# EAGLE board eBay1 (EAGLE 6.6.0), part 1 of 7
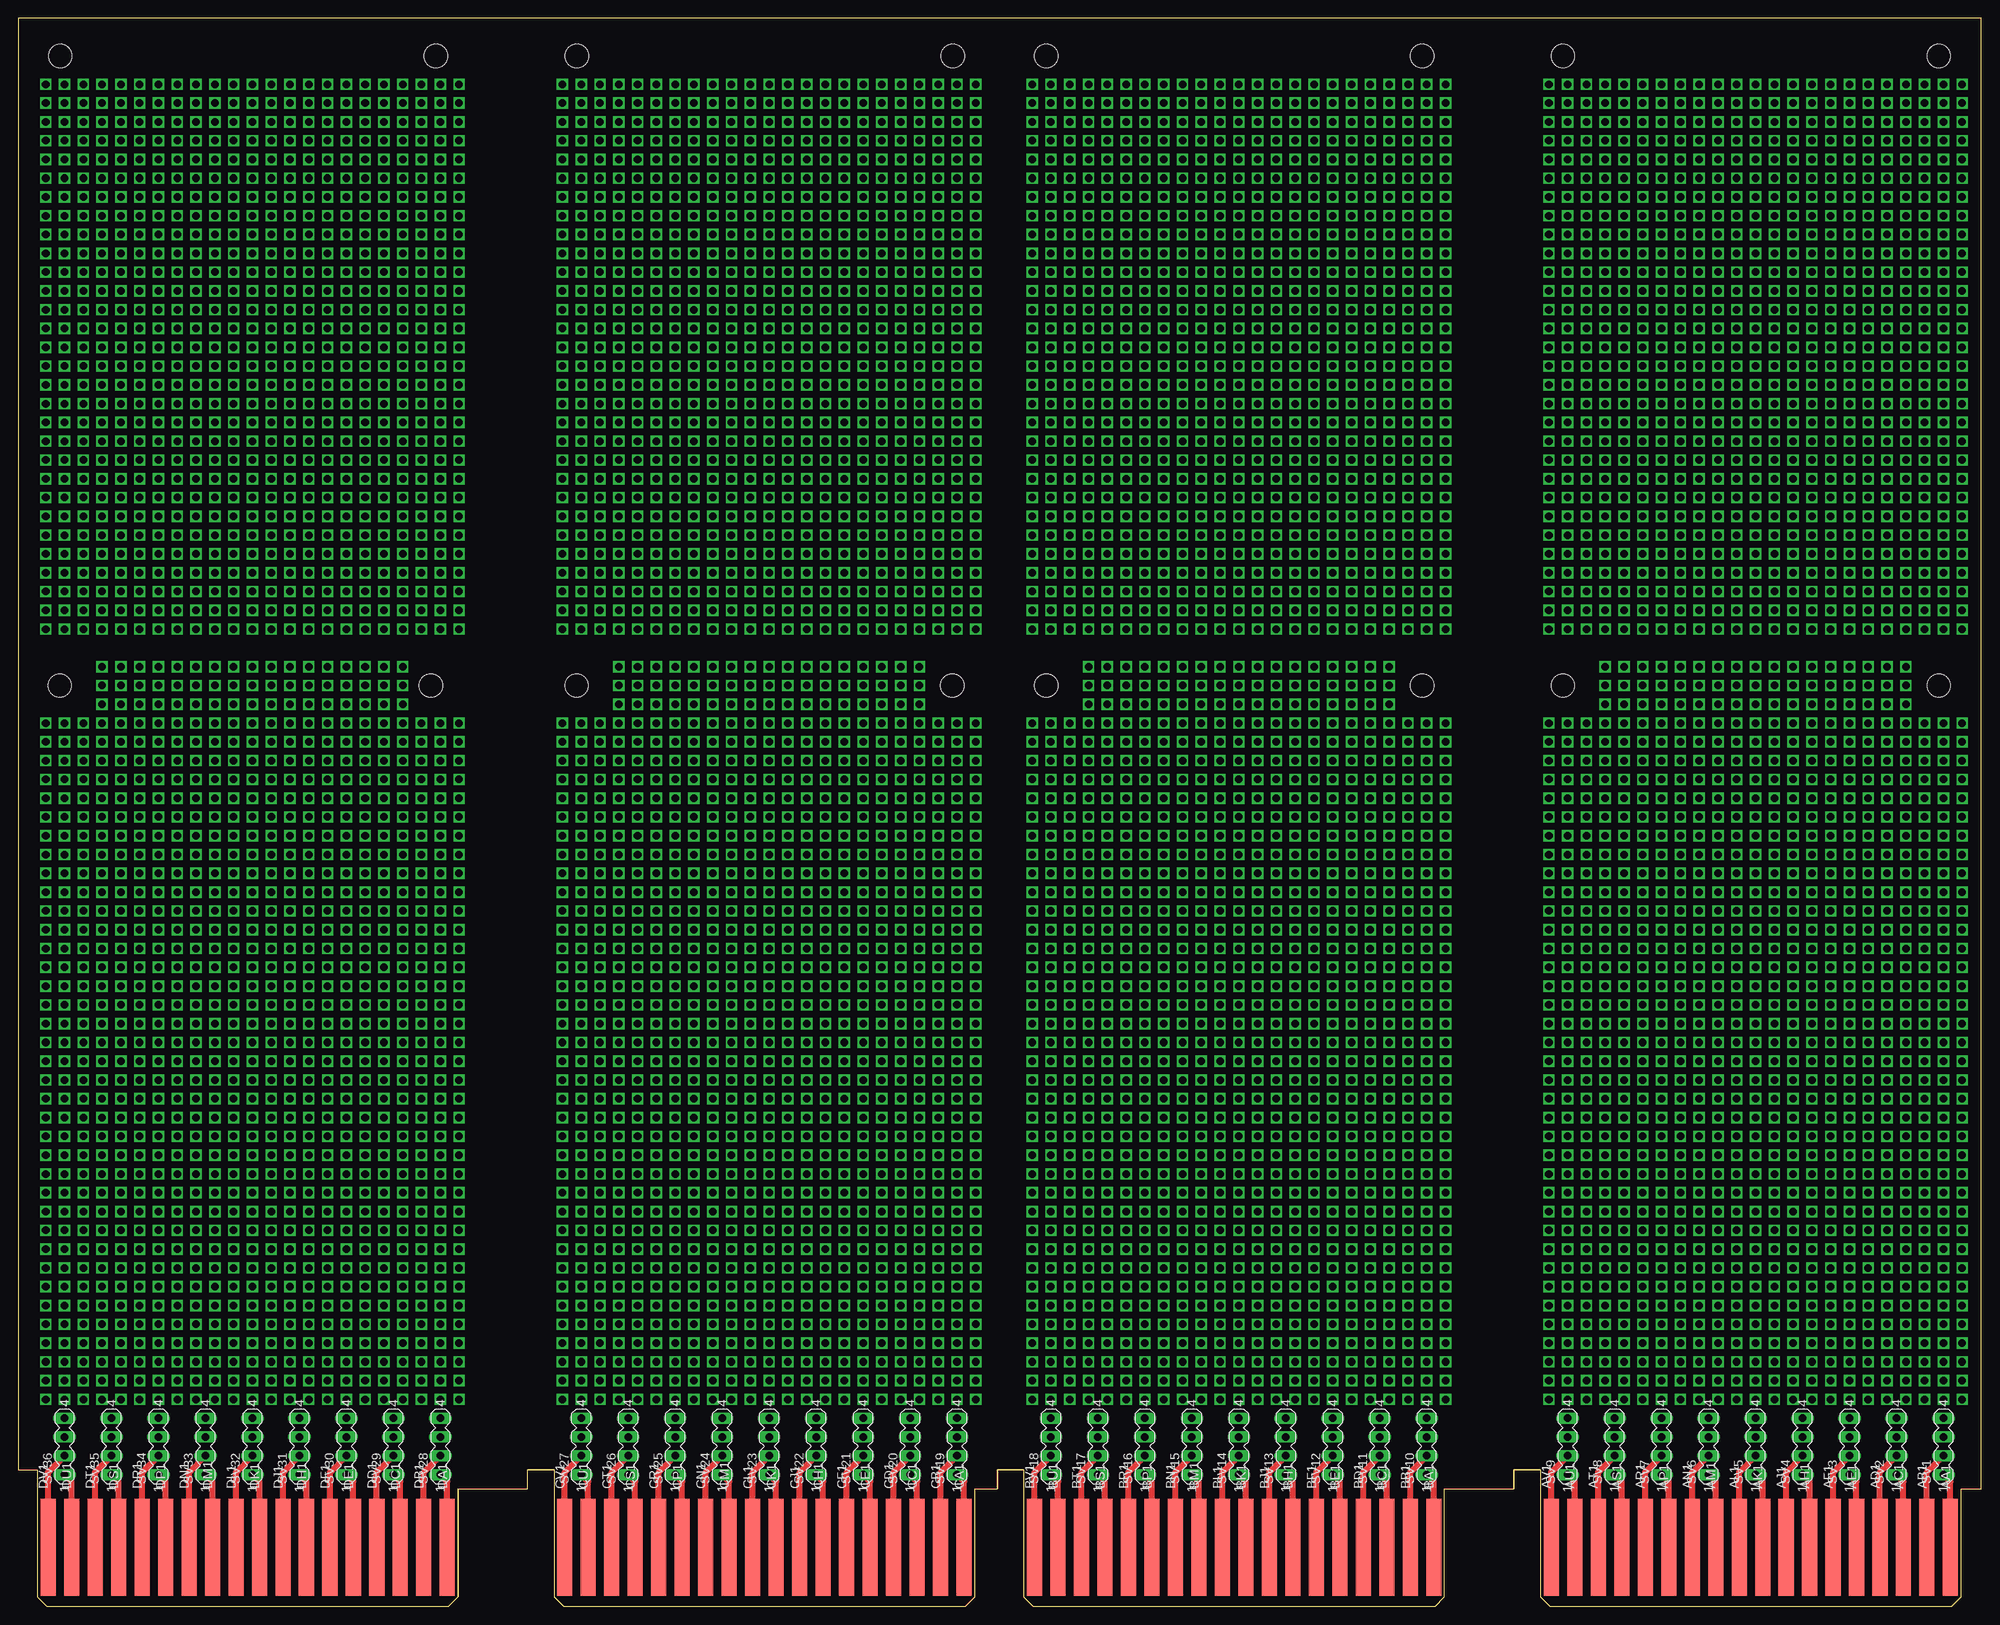
[diagram p1: board, top side]
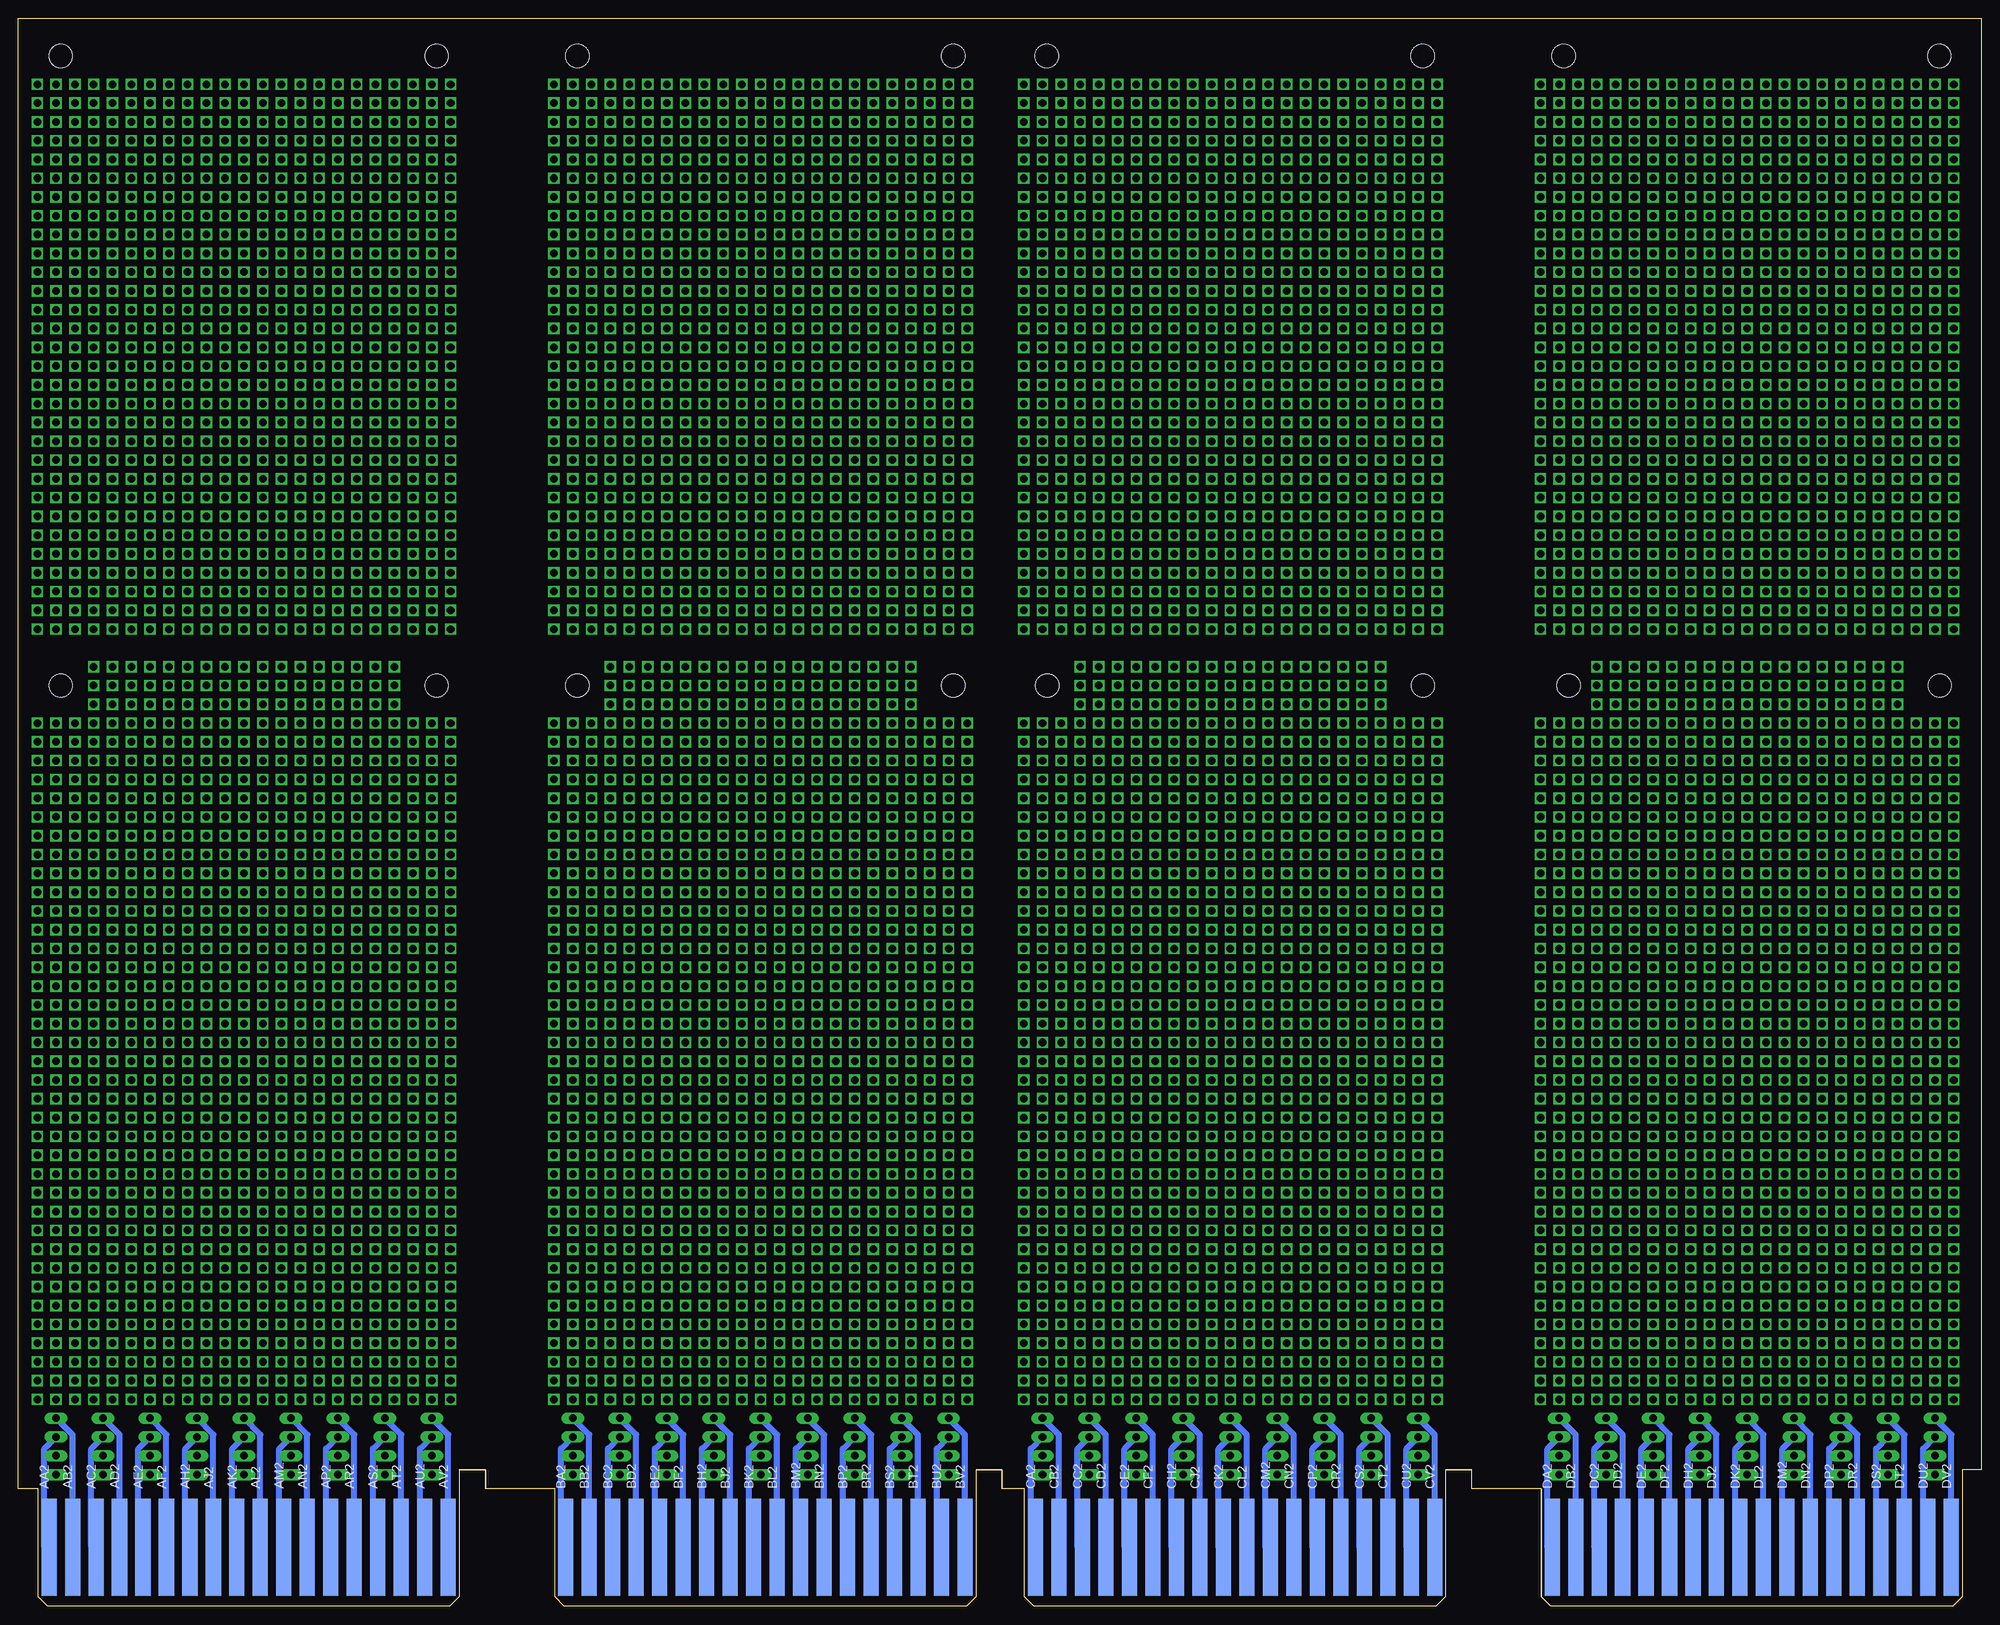
[diagram p2: board, bottom side, seen from below]

Size 265.3 x 214.63 mm. Coordinates in mm from the lower left corner, seen from the top.
Copper layers (1+16): Top 0.035mm / dielectric 1.5mm / Bottom 0.035mm
Design rules "16mils *": minimum track width 16mil, minimum drill 32mil, track to track 15mil, track to pad 10mil, pad to pad 10mil, via to via 10mil, smd to smd 10mil, copper to edge 13mil, drill to drill 10mil, minimum pad ring 10mil, minimum via ring 8mil, stop-mask expansion 0mil, vias tented up to drill 0mil, thermal gap 10mil
Net classes: 0 default: width 0.813 mm
Holes 3.17 mm at 5.59,124.46 55.75,124.46 75.44,124.46 126.24,124.46 138.94,124.46 189.74,124.46 208.79,124.46 259.59,124.46

## Footprints (pad centres in the part's own frame; a part is rotated, then mirrored left to right if it is on the bottom)
MA04-1 = drill 1.016 long: 1 -3.81,0; 2 -1.27,0; 3 1.27,0; 4 3.81,0
OMNIBUS = hole 3.175: 208.915,209.55; 259.715,209.55; 189.865,209.55; 139.065,209.55; 75.616,209.55; 126.416,209.55; 56.566,209.55; 5.766,209.55
EDGE-CON8 = smd 2.032 x 13.106: AA1 261.303,7.938; AB1 258.127,7.938; AC1 254.952,7.938; AD1 251.778,7.938; AE1 248.602,7.938; AF1 245.428,7.938; AH1 242.252,7.938; AJ1 239.077,7.938; AK1 235.903,7.938; AL1 232.727,7.938; AM1 229.553,7.938; AN1 226.377,7.938; AP1 223.202,7.938; AR1 220.028,7.938; AS1 216.852,7.938; AT1 213.678,7.938; AU1 210.502,7.938; AV1 207.327,7.938; BA1 191.452,7.938; BB1 188.278,7.938; BC1 185.102,7.938; BD1 181.928,7.938; BE1 178.752,7.938; BF1 175.577,7.938; BH1 172.403,7.938; BJ1 169.227,7.938; BK1 166.053,7.938; BL1 162.877,7.938; BM1 159.702,7.938; BN1 156.528,7.938; BP1 153.352,7.938; BR1 150.178,7.938; BS1 147.002,7.938; BT1 143.827,7.938; BU1 140.653,7.938; BV1 137.477,7.938; CA1 127.953,7.938; CB1 124.778,7.938; CC1 121.603,7.938; CD1 118.427,7.938; CE1 115.252,7.938; CF1 112.078,7.938; CH1 108.903,7.938; CJ1 105.728,7.938; CK1 102.552,7.938; CL1 99.377,7.938; CM1 96.203,7.938; CN1 93.028,7.938; CP1 89.853,7.938; CR1 86.677,7.938; CS1 83.502,7.938; CT1 80.328,7.938; CU1 77.153,7.938; CV1 73.978,7.938; DA1 58.102,7.938; DB1 54.928,7.938; DC1 51.752,7.938; DD1 48.578,7.938; DE1 45.403,7.938; DF1 42.227,7.938; DH1 39.053,7.938; DJ1 35.877,7.938; DK1 32.703,7.938; DL1 29.527,7.938; DM1 26.352,7.938; DN1 23.177,7.938; DP1 20.003,7.938; DR1 16.828,7.938; DS1 13.652,7.938; DT1 10.477,7.938; DU1 7.303,7.938; DV1 4.128,7.938 | smd 2.032 x 13.106 bottom: AA2 261.303,7.938; AB2 258.127,7.938; AC2 254.952,7.938; AD2 251.778,7.938; AE2 248.602,7.938; AF2 245.428,7.938; AH2 242.252,7.938; AJ2 239.077,7.938; AK2 235.903,7.938; AL2 232.727,7.938; AM2 229.553,7.938; AN2 226.377,7.938; AP2 223.202,7.938; AR2 220.028,7.938; AS2 216.852,7.938; AT2 213.678,7.938; AU2 210.502,7.938; AV2 207.327,7.938; BA2 191.452,7.938; BB2 188.278,7.938; BC2 185.102,7.938; BD2 181.928,7.938; BE2 178.752,7.938; BF2 175.577,7.938; BH2 172.403,7.938; BJ2 169.227,7.938; BK2 166.053,7.938; BL2 162.877,7.938; BM2 159.702,7.938; BN2 156.528,7.938; BP2 153.352,7.938; BR2 150.178,7.938; BS2 147.002,7.938; BT2 143.827,7.938; BU2 140.653,7.938; BV2 137.477,7.938; CA2 127.953,7.938; CB2 124.778,7.938; CC2 121.603,7.938; CD2 118.427,7.938; CE2 115.252,7.938; CF2 112.078,7.938; CH2 108.903,7.938; CJ2 105.728,7.938; CK2 102.552,7.938; CL2 99.377,7.938; CM2 96.203,7.938; CN2 93.028,7.938; CP2 89.853,7.938; CR2 86.677,7.938; CS2 83.502,7.938; CT2 80.328,7.938; CU2 77.153,7.938; CV2 73.978,7.938; DA2 58.102,7.938; DB2 54.928,7.938; DC2 51.752,7.938; DD2 48.578,7.938; DE2 45.403,7.938; DF2 42.227,7.938; DH2 39.053,7.938; DJ2 35.877,7.938; DK2 32.703,7.938; DL2 29.527,7.938; DM2 26.352,7.938; DN2 23.177,7.938; DP2 20.003,7.938; DR2 16.828,7.938; DS2 13.652,7.938; DT2 10.477,7.938; DU2 7.303,7.938; DV2 4.128,7.938

## Placement (x,y rotation side)
SV1  [MA04-1]  260.22,21.59 90 top
SV2  [MA04-1]  253.87,21.59 90 top
SV3  [MA04-1]  247.52,21.59 90 top
SV4  [MA04-1]  241.17,21.59 90 top
SV5  [MA04-1]  234.82,21.59 90 top
SV6  [MA04-1]  228.47,21.59 90 top
SV7  [MA04-1]  222.12,21.59 90 top
SV8  [MA04-1]  215.77,21.59 90 top
SV9  [MA04-1]  209.42,21.59 90 top
SV10  [MA04-1]  190.37,21.59 90 top
SV11  [MA04-1]  184.02,21.59 90 top
SV12  [MA04-1]  177.67,21.59 90 top
SV13  [MA04-1]  171.32,21.59 90 top
SV14  [MA04-1]  164.97,21.59 90 top
SV15  [MA04-1]  158.62,21.59 90 top
SV16  [MA04-1]  152.27,21.59 90 top
SV17  [MA04-1]  145.92,21.59 90 top
SV18  [MA04-1]  139.57,21.59 90 top
SV19  [MA04-1]  126.87,21.59 90 top
SV20  [MA04-1]  120.52,21.59 90 top
SV21  [MA04-1]  114.17,21.59 90 top
SV22  [MA04-1]  107.82,21.59 90 top
SV23  [MA04-1]  101.47,21.59 90 top
SV24  [MA04-1]  95.12,21.59 90 top
SV25  [MA04-1]  88.77,21.59 90 top
SV26  [MA04-1]  82.42,21.59 90 top
SV27  [MA04-1]  76.07,21.59 90 top
SV28  [MA04-1]  57.02,21.59 90 top
SV29  [MA04-1]  50.67,21.59 90 top
SV30  [MA04-1]  44.32,21.59 90 top
SV31  [MA04-1]  37.97,21.59 90 top
SV32  [MA04-1]  31.62,21.59 90 top
SV33  [MA04-1]  25.27,21.59 90 top
SV34  [MA04-1]  18.92,21.59 90 top
SV35  [MA04-1]  12.57,21.59 90 top
SV36  [MA04-1]  6.22,21.59 90 top
U$1  OUTLINE-OMNIBUS  [OMNIBUS]  -0.13,0 0 top
U$2  QUAD  [EDGE-CON8]  -0.13,0 0 top

## Tracks (layer width: path | path; a pad name or v marks a point on that pad's centre or on a via)
N$1  (via drill 1.02)
  other vias: 262.76,27.94
N$2  (via drill 1.02)
  other vias: 260.22,27.94
N$3  (via drill 1.02)
  other vias: 257.68,27.94
N$4  (via drill 1.02)
  other vias: 255.14,27.94
N$5  (via drill 1.02)
  other vias: 252.6,27.94
N$6  (via drill 1.02)
  other vias: 250.06,27.94
N$7  (via drill 1.02)
  other vias: 247.52,27.94
N$8  (via drill 1.02)
  other vias: 244.98,27.94
N$9  (via drill 1.02)
  other vias: 242.44,27.94
N$10  (via drill 1.02)
  other vias: 239.9,27.94
N$11  (via drill 1.02)
  other vias: 237.36,27.94
N$12  (via drill 1.02)
  other vias: 234.82,27.94
N$13  (via drill 1.02)
  other vias: 232.28,27.94
N$14  (via drill 1.02)
  other vias: 229.74,27.94
N$15  (via drill 1.02)
  other vias: 227.2,27.94
N$16  (via drill 1.02)
  other vias: 224.66,27.94
N$17  (via drill 1.02)
  other vias: 222.12,27.94
N$18  (via drill 1.02)
  other vias: 219.58,27.94
N$19  (via drill 1.02)
  other vias: 217.04,27.94
N$20  (via drill 1.02)
  other vias: 214.5,27.94
N$21  (via drill 1.02)
  other vias: 211.96,27.94
N$22  (via drill 1.02)
  other vias: 209.42,27.94
N$23  (via drill 1.02)
  other vias: 206.88,27.94
N$24  (via drill 1.02)
  other vias: 192.91,27.94
N$25  (via drill 1.02)
  other vias: 190.37,27.94
N$26  (via drill 1.02)
  other vias: 262.76,30.48
N$27  (via drill 1.02)
  other vias: 260.22,30.48
N$28  (via drill 1.02)
  other vias: 257.68,30.48
N$29  (via drill 1.02)
  other vias: 255.14,30.48
N$30  (via drill 1.02)
  other vias: 252.6,30.48
N$31  (via drill 1.02)
  other vias: 250.06,30.48
N$32  (via drill 1.02)
  other vias: 247.52,30.48
N$33  (via drill 1.02)
  other vias: 244.98,30.48
N$34  (via drill 1.02)
  other vias: 242.44,30.48
N$35  (via drill 1.02)
  other vias: 239.9,30.48
N$36  (via drill 1.02)
  other vias: 237.36,30.48
N$37  (via drill 1.02)
  other vias: 234.82,30.48
N$38  (via drill 1.02)
  other vias: 232.28,30.48
N$39  (via drill 1.02)
  other vias: 229.74,30.48
N$40  (via drill 1.02)
  other vias: 227.2,30.48
N$41  (via drill 1.02)
  other vias: 224.66,30.48
N$42  (via drill 1.02)
  other vias: 222.12,30.48
N$43  (via drill 1.02)
  other vias: 219.58,30.48
N$44  (via drill 1.02)
  other vias: 217.04,30.48
N$45  (via drill 1.02)
  other vias: 214.5,30.48
N$46  (via drill 1.02)
  other vias: 211.96,30.48
N$47  (via drill 1.02)
  other vias: 209.42,30.48
N$48  (via drill 1.02)
  other vias: 206.88,30.48
N$49  (via drill 1.02)
  other vias: 187.83,27.94
N$50  (via drill 1.02)
  other vias: 185.29,27.94
N$51  (via drill 1.02)
  other vias: 262.76,33.02
N$52  (via drill 1.02)
  other vias: 260.22,33.02
N$53  (via drill 1.02)
  other vias: 257.68,33.02
N$54  (via drill 1.02)
  other vias: 255.14,33.02
N$55  (via drill 1.02)
  other vias: 252.6,33.02
N$56  (via drill 1.02)
  other vias: 250.06,33.02
N$57  (via drill 1.02)
  other vias: 247.52,33.02
N$58  (via drill 1.02)
  other vias: 244.98,33.02
N$59  (via drill 1.02)
  other vias: 242.44,33.02
N$60  (via drill 1.02)
  other vias: 239.9,33.02
N$61  (via drill 1.02)
  other vias: 237.36,33.02
N$62  (via drill 1.02)
  other vias: 234.82,33.02
N$63  (via drill 1.02)
  other vias: 232.28,33.02
N$64  (via drill 1.02)
  other vias: 229.74,33.02
N$65  (via drill 1.02)
  other vias: 227.2,33.02
N$66  (via drill 1.02)
  other vias: 224.66,33.02
N$67  (via drill 1.02)
  other vias: 222.12,33.02
N$68  (via drill 1.02)
  other vias: 219.58,33.02
N$69  (via drill 1.02)
  other vias: 217.04,33.02
N$70  (via drill 1.02)
  other vias: 214.5,33.02
N$71  (via drill 1.02)
  other vias: 211.96,33.02
N$72  (via drill 1.02)
  other vias: 209.42,33.02
N$73  (via drill 1.02)
  other vias: 206.88,33.02
N$74  (via drill 1.02)
  other vias: 182.75,27.94
N$75  (via drill 1.02)
  other vias: 180.21,27.94
N$76  (via drill 1.02)
  other vias: 262.76,35.56
N$77  (via drill 1.02)
  other vias: 260.22,35.56
N$78  (via drill 1.02)
  other vias: 257.68,35.56
N$79  (via drill 1.02)
  other vias: 255.14,35.56
N$80  (via drill 1.02)
  other vias: 252.6,35.56
N$81  (via drill 1.02)
  other vias: 250.06,35.56
N$82  (via drill 1.02)
  other vias: 247.52,35.56
N$83  (via drill 1.02)
  other vias: 244.98,35.56
N$84  (via drill 1.02)
  other vias: 242.44,35.56
N$85  (via drill 1.02)
  other vias: 239.9,35.56
N$86  (via drill 1.02)
  other vias: 237.36,35.56
N$87  (via drill 1.02)
  other vias: 234.82,35.56
N$88  (via drill 1.02)
  other vias: 232.28,35.56
N$89  (via drill 1.02)
  other vias: 229.74,35.56
N$90  (via drill 1.02)
  other vias: 227.2,35.56
N$91  (via drill 1.02)
  other vias: 224.66,35.56
N$92  (via drill 1.02)
  other vias: 222.12,35.56
N$93  (via drill 1.02)
  other vias: 219.58,35.56
N$94  (via drill 1.02)
  other vias: 217.04,35.56
N$95  (via drill 1.02)
  other vias: 214.5,35.56
N$96  (via drill 1.02)
  other vias: 211.96,35.56
N$97  (via drill 1.02)
  other vias: 209.42,35.56
N$98  (via drill 1.02)
  other vias: 206.88,35.56
N$99  (via drill 1.02)
  other vias: 177.67,27.94
N$100  (via drill 1.02)
  other vias: 175.13,27.94
N$101  (via drill 1.02)
  other vias: 262.76,38.1
N$102  (via drill 1.02)
  other vias: 260.22,38.1
N$103  (via drill 1.02)
  other vias: 257.68,38.1
N$104  (via drill 1.02)
  other vias: 255.14,38.1
N$105  (via drill 1.02)
  other vias: 252.6,38.1
N$106  (via drill 1.02)
  other vias: 250.06,38.1
N$107  (via drill 1.02)
  other vias: 247.52,38.1
N$108  (via drill 1.02)
  other vias: 244.98,38.1
N$109  (via drill 1.02)
  other vias: 242.44,38.1
N$110  (via drill 1.02)
  other vias: 239.9,38.1
N$111  (via drill 1.02)
  other vias: 237.36,38.1
N$112  (via drill 1.02)
  other vias: 234.82,38.1
N$113  (via drill 1.02)
  other vias: 232.28,38.1
N$114  (via drill 1.02)
  other vias: 229.74,38.1
N$115  (via drill 1.02)
  other vias: 227.2,38.1
N$116  (via drill 1.02)
  other vias: 224.66,38.1
N$117  (via drill 1.02)
  other vias: 222.12,38.1
N$118  (via drill 1.02)
  other vias: 219.58,38.1
N$119  (via drill 1.02)
  other vias: 217.04,38.1
N$120  (via drill 1.02)
  other vias: 214.5,38.1
N$121  (via drill 1.02)
  other vias: 211.96,38.1
N$122  (via drill 1.02)
  other vias: 209.42,38.1
N$123  (via drill 1.02)
  other vias: 206.88,38.1
N$124  (via drill 1.02)
  other vias: 172.59,27.94
N$125  (via drill 1.02)
  other vias: 170.05,27.94
N$126  (via drill 1.02)
  other vias: 262.76,40.64
N$127  (via drill 1.02)
  other vias: 260.22,40.64
N$128  (via drill 1.02)
  other vias: 257.68,40.64
N$129  (via drill 1.02)
  other vias: 255.14,40.64
N$130  (via drill 1.02)
  other vias: 252.6,40.64
N$131  (via drill 1.02)
  other vias: 250.06,40.64
N$132  (via drill 1.02)
  other vias: 247.52,40.64
N$133  (via drill 1.02)
  other vias: 244.98,40.64
N$134  (via drill 1.02)
  other vias: 242.44,40.64
N$135  (via drill 1.02)
  other vias: 239.9,40.64
N$136  (via drill 1.02)
  other vias: 237.36,40.64
N$137  (via drill 1.02)
  other vias: 234.82,40.64
N$138  (via drill 1.02)
  other vias: 232.28,40.64
N$139  (via drill 1.02)
  other vias: 229.74,40.64
N$140  (via drill 1.02)
  other vias: 227.2,40.64
N$141  (via drill 1.02)
  other vias: 224.66,40.64
N$142  (via drill 1.02)
  other vias: 222.12,40.64
N$143  (via drill 1.02)
  other vias: 219.58,40.64
N$144  (via drill 1.02)
  other vias: 217.04,40.64
N$145  (via drill 1.02)
  other vias: 214.5,40.64
N$146  (via drill 1.02)
  other vias: 211.96,40.64
N$147  (via drill 1.02)
  other vias: 209.42,40.64
N$148  (via drill 1.02)
  other vias: 206.88,40.64
N$149  (via drill 1.02)
  other vias: 167.51,27.94
N$150  (via drill 1.02)
  other vias: 164.97,27.94
N$151  (via drill 1.02)
  other vias: 262.76,43.18
N$152  (via drill 1.02)
  other vias: 260.22,43.18
N$153  (via drill 1.02)
  other vias: 257.68,43.18
N$154  (via drill 1.02)
  other vias: 255.14,43.18
N$155  (via drill 1.02)
  other vias: 252.6,43.18
N$156  (via drill 1.02)
  other vias: 250.06,43.18
N$157  (via drill 1.02)
  other vias: 247.52,43.18
N$158  (via drill 1.02)
  other vias: 244.98,43.18
N$159  (via drill 1.02)
  other vias: 242.44,43.18
N$160  (via drill 1.02)
  other vias: 239.9,43.18
N$161  (via drill 1.02)
  other vias: 237.36,43.18
N$162  (via drill 1.02)
  other vias: 234.82,43.18
N$163  (via drill 1.02)
  other vias: 232.28,43.18
N$164  (via drill 1.02)
  other vias: 229.74,43.18
N$165  (via drill 1.02)
  other vias: 227.2,43.18
N$166  (via drill 1.02)
  other vias: 224.66,43.18
N$167  (via drill 1.02)
  other vias: 222.12,43.18
N$168  (via drill 1.02)
  other vias: 219.58,43.18
N$169  (via drill 1.02)
  other vias: 217.04,43.18
N$170  (via drill 1.02)
  other vias: 214.5,43.18
N$171  (via drill 1.02)
  other vias: 211.96,43.18
N$172  (via drill 1.02)
  other vias: 209.42,43.18
N$173  (via drill 1.02)
  other vias: 206.88,43.18
N$174  (via drill 1.02)
  other vias: 162.43,27.94
N$175  (via drill 1.02)
  other vias: 159.89,27.94
N$176  (via drill 1.02)
  other vias: 262.76,45.72
N$177  (via drill 1.02)
  other vias: 260.22,45.72
N$178  (via drill 1.02)
  other vias: 257.68,45.72
N$179  (via drill 1.02)
  other vias: 255.14,45.72
N$180  (via drill 1.02)
  other vias: 252.6,45.72
N$181  (via drill 1.02)
  other vias: 250.06,45.72
N$182  (via drill 1.02)
  other vias: 247.52,45.72
N$183  (via drill 1.02)
  other vias: 244.98,45.72
N$184  (via drill 1.02)
  other vias: 242.44,45.72
N$185  (via drill 1.02)
  other vias: 239.9,45.72
N$186  (via drill 1.02)
  other vias: 237.36,45.72
N$187  (via drill 1.02)
  other vias: 234.82,45.72
N$188  (via drill 1.02)
  other vias: 232.28,45.72
N$189  (via drill 1.02)
  other vias: 229.74,45.72
N$190  (via drill 1.02)
  other vias: 227.2,45.72
N$191  (via drill 1.02)
  other vias: 224.66,45.72
N$192  (via drill 1.02)
  other vias: 222.12,45.72
N$193  (via drill 1.02)
  other vias: 219.58,45.72
N$194  (via drill 1.02)
  other vias: 217.04,45.72
N$195  (via drill 1.02)
  other vias: 214.5,45.72
N$196  (via drill 1.02)
  other vias: 211.96,45.72
N$197  (via drill 1.02)
  other vias: 209.42,45.72
N$198  (via drill 1.02)
  other vias: 206.88,45.72
N$199  (via drill 1.02)
  other vias: 157.35,27.94
N$200  (via drill 1.02)
  other vias: 154.81,27.94
N$201  (via drill 1.02)
  other vias: 262.76,48.26
N$202  (via drill 1.02)
  other vias: 260.22,48.26
N$203  (via drill 1.02)
  other vias: 257.68,48.26
N$204  (via drill 1.02)
  other vias: 255.14,48.26
N$205  (via drill 1.02)
  other vias: 252.6,48.26
N$206  (via drill 1.02)
  other vias: 250.06,48.26
N$207  (via drill 1.02)
  other vias: 247.52,48.26
N$208  (via drill 1.02)
  other vias: 244.98,48.26
N$209  (via drill 1.02)
  other vias: 242.44,48.26
N$210  (via drill 1.02)
  other vias: 239.9,48.26
N$211  (via drill 1.02)
  other vias: 237.36,48.26
N$212  (via drill 1.02)
  other vias: 234.82,48.26
N$213  (via drill 1.02)
  other vias: 232.28,48.26
N$214  (via drill 1.02)
  other vias: 229.74,48.26
N$215  (via drill 1.02)
  other vias: 227.2,48.26
N$216  (via drill 1.02)
  other vias: 224.66,48.26
N$217  (via drill 1.02)
  other vias: 222.12,48.26
N$218  (via drill 1.02)
  other vias: 219.58,48.26
N$219  (via drill 1.02)
  other vias: 217.04,48.26
N$220  (via drill 1.02)
  other vias: 214.5,48.26
N$221  (via drill 1.02)
  other vias: 211.96,48.26
N$222  (via drill 1.02)
  other vias: 209.42,48.26
N$223  (via drill 1.02)
  other vias: 206.88,48.26
N$224  (via drill 1.02)
  other vias: 152.27,27.94
N$225  (via drill 1.02)
  other vias: 149.73,27.94
N$226  (via drill 1.02)
  other vias: 262.76,50.8
N$227  (via drill 1.02)
  other vias: 260.22,50.8
N$228  (via drill 1.02)
  other vias: 257.68,50.8
N$229  (via drill 1.02)
  other vias: 255.14,50.8
N$230  (via drill 1.02)
  other vias: 252.6,50.8
N$231  (via drill 1.02)
  other vias: 250.06,50.8
N$232  (via drill 1.02)
  other vias: 247.52,50.8
N$233  (via drill 1.02)
  other vias: 244.98,50.8
N$234  (via drill 1.02)
  other vias: 242.44,50.8
N$235  (via drill 1.02)
  other vias: 239.9,50.8
N$236  (via drill 1.02)
  other vias: 237.36,50.8
N$237  (via drill 1.02)
  other vias: 234.82,50.8
N$238  (via drill 1.02)
  other vias: 232.28,50.8
N$239  (via drill 1.02)
  other vias: 229.74,50.8
N$240  (via drill 1.02)
  other vias: 227.2,50.8
N$241  (via drill 1.02)
  other vias: 224.66,50.8
N$242  (via drill 1.02)
  other vias: 222.12,50.8
N$243  (via drill 1.02)
  other vias: 219.58,50.8
N$244  (via drill 1.02)
  other vias: 217.04,50.8
N$245  (via drill 1.02)
  other vias: 214.5,50.8
N$246  (via drill 1.02)
  other vias: 211.96,50.8
N$247  (via drill 1.02)
  other vias: 209.42,50.8
N$248  (via drill 1.02)
  other vias: 206.88,50.8
N$249  (via drill 1.02)
  other vias: 147.19,27.94
N$250  (via drill 1.02)
  other vias: 144.65,27.94
N$251  (via drill 1.02)
  other vias: 262.76,53.34
N$252  (via drill 1.02)
  other vias: 260.22,53.34
N$253  (via drill 1.02)
  other vias: 257.68,53.34
N$254  (via drill 1.02)
  other vias: 255.14,53.34
N$255  (via drill 1.02)
  other vias: 252.6,53.34
N$256  (via drill 1.02)
  other vias: 250.06,53.34
N$257  (via drill 1.02)
  other vias: 247.52,53.34
N$258  (via drill 1.02)
  other vias: 244.98,53.34
N$259  (via drill 1.02)
  other vias: 242.44,53.34
N$260  (via drill 1.02)
  other vias: 239.9,53.34
N$261  (via drill 1.02)
  other vias: 237.36,53.34
N$262  (via drill 1.02)
  other vias: 234.82,53.34
N$263  (via drill 1.02)
  other vias: 232.28,53.34
N$264  (via drill 1.02)
  other vias: 229.74,53.34
N$265  (via drill 1.02)
  other vias: 227.2,53.34
N$266  (via drill 1.02)
  other vias: 224.66,53.34
N$267  (via drill 1.02)
  other vias: 222.12,53.34
N$268  (via drill 1.02)
  other vias: 219.58,53.34
N$269  (via drill 1.02)
  other vias: 217.04,53.34
N$270  (via drill 1.02)
  other vias: 214.5,53.34
N$271  (via drill 1.02)
  other vias: 211.96,53.34
N$272  (via drill 1.02)
  other vias: 209.42,53.34
N$273  (via drill 1.02)
  other vias: 206.88,53.34
N$274  (via drill 1.02)
  other vias: 142.11,27.94
N$275  (via drill 1.02)
  other vias: 139.57,27.94
N$276  (via drill 1.02)
  other vias: 262.76,55.88
N$277  (via drill 1.02)
  other vias: 260.22,55.88
N$278  (via drill 1.02)
  other vias: 257.68,55.88
N$279  (via drill 1.02)
  other vias: 255.14,55.88
N$280  (via drill 1.02)
  other vias: 252.6,55.88
N$281  (via drill 1.02)
  other vias: 250.06,55.88
N$282  (via drill 1.02)
  other vias: 247.52,55.88
N$283  (via drill 1.02)
  other vias: 244.98,55.88
N$284  (via drill 1.02)
  other vias: 242.44,55.88
N$285  (via drill 1.02)
  other vias: 239.9,55.88
N$286  (via drill 1.02)
  other vias: 237.36,55.88
N$287  (via drill 1.02)
  other vias: 234.82,55.88
N$288  (via drill 1.02)
  other vias: 232.28,55.88
N$289  (via drill 1.02)
  other vias: 229.74,55.88
N$290  (via drill 1.02)
  other vias: 227.2,55.88
N$291  (via drill 1.02)
  other vias: 224.66,55.88
N$292  (via drill 1.02)
  other vias: 222.12,55.88
N$293  (via drill 1.02)
  other vias: 219.58,55.88
N$294  (via drill 1.02)
  other vias: 217.04,55.88
N$295  (via drill 1.02)
  other vias: 214.5,55.88
N$296  (via drill 1.02)
  other vias: 211.96,55.88
N$297  (via drill 1.02)
  other vias: 209.42,55.88
N$298  (via drill 1.02)
  other vias: 206.88,55.88
N$299  (via drill 1.02)
  other vias: 137.03,27.94
N$300  (via drill 1.02)
  other vias: 192.91,30.48
N$301  (via drill 1.02)
  other vias: 262.76,58.42
N$302  (via drill 1.02)
  other vias: 260.22,58.42
N$303  (via drill 1.02)
  other vias: 257.68,58.42
N$304  (via drill 1.02)
  other vias: 255.14,58.42
N$305  (via drill 1.02)
  other vias: 252.6,58.42
N$306  (via drill 1.02)
  other vias: 250.06,58.42
N$307  (via drill 1.02)
  other vias: 247.52,58.42
N$308  (via drill 1.02)
  other vias: 244.98,58.42
N$309  (via drill 1.02)
  other vias: 242.44,58.42
N$310  (via drill 1.02)
  other vias: 239.9,58.42
N$311  (via drill 1.02)
  other vias: 237.36,58.42
N$312  (via drill 1.02)
  other vias: 234.82,58.42
N$313  (via drill 1.02)
  other vias: 232.28,58.42
N$314  (via drill 1.02)
  other vias: 229.74,58.42
N$315  (via drill 1.02)
  other vias: 227.2,58.42
N$316  (via drill 1.02)
  other vias: 224.66,58.42
N$317  (via drill 1.02)
  other vias: 222.12,58.42
N$318  (via drill 1.02)
  other vias: 219.58,58.42
N$319  (via drill 1.02)
  other vias: 217.04,58.42
N$320  (via drill 1.02)
  other vias: 214.5,58.42
N$321  (via drill 1.02)
  other vias: 211.96,58.42
N$322  (via drill 1.02)
  other vias: 209.42,58.42
N$323  (via drill 1.02)
  other vias: 206.88,58.42
N$324  (via drill 1.02)
  other vias: 190.37,30.48
N$325  (via drill 1.02)
  other vias: 187.83,30.48
N$326  (via drill 1.02)
  other vias: 262.76,60.96
N$327  (via drill 1.02)
  other vias: 260.22,60.96
N$328  (via drill 1.02)
  other vias: 257.68,60.96
N$329  (via drill 1.02)
  other vias: 255.14,60.96
N$330  (via drill 1.02)
  other vias: 252.6,60.96
N$331  (via drill 1.02)
  other vias: 250.06,60.96
N$332  (via drill 1.02)
  other vias: 247.52,60.96
N$333  (via drill 1.02)
  other vias: 244.98,60.96
N$334  (via drill 1.02)
  other vias: 242.44,60.96
N$335  (via drill 1.02)
  other vias: 239.9,60.96
N$336  (via drill 1.02)
  other vias: 237.36,60.96
N$337  (via drill 1.02)
  other vias: 234.82,60.96
N$338  (via drill 1.02)
  other vias: 232.28,60.96
N$339  (via drill 1.02)
  other vias: 229.74,60.96
N$340  (via drill 1.02)
  other vias: 227.2,60.96
N$341  (via drill 1.02)
  other vias: 224.66,60.96
N$342  (via drill 1.02)
  other vias: 222.12,60.96
N$343  (via drill 1.02)
  other vias: 219.58,60.96
N$344  (via drill 1.02)
  other vias: 217.04,60.96
N$345  (via drill 1.02)
  other vias: 214.5,60.96
N$346  (via drill 1.02)
  other vias: 211.96,60.96
N$347  (via drill 1.02)
  other vias: 209.42,60.96
N$348  (via drill 1.02)
  other vias: 206.88,60.96
N$349  (via drill 1.02)
  other vias: 185.29,30.48
N$350  (via drill 1.02)
  other vias: 182.75,30.48
N$351  (via drill 1.02)
  other vias: 262.76,63.5
N$352  (via drill 1.02)
  other vias: 260.22,63.5
N$353  (via drill 1.02)
  other vias: 257.68,63.5
N$354  (via drill 1.02)
  other vias: 255.14,63.5
N$355  (via drill 1.02)
  other vias: 252.6,63.5
N$356  (via drill 1.02)
  other vias: 250.06,63.5
N$357  (via drill 1.02)
  other vias: 247.52,63.5
N$358  (via drill 1.02)
  other vias: 244.98,63.5
N$359  (via drill 1.02)
  other vias: 242.44,63.5
N$360  (via drill 1.02)
  other vias: 239.9,63.5
N$361  (via drill 1.02)
  other vias: 237.36,63.5
N$362  (via drill 1.02)
  other vias: 234.82,63.5
N$363  (via drill 1.02)
  other vias: 232.28,63.5
N$364  (via drill 1.02)
  other vias: 229.74,63.5
N$365  (via drill 1.02)
  other vias: 227.2,63.5
N$366  (via drill 1.02)
  other vias: 224.66,63.5
N$367  (via drill 1.02)
  other vias: 222.12,63.5
N$368  (via drill 1.02)
  other vias: 219.58,63.5
N$369  (via drill 1.02)
  other vias: 217.04,63.5
N$370  (via drill 1.02)
  other vias: 214.5,63.5
N$371  (via drill 1.02)
  other vias: 211.96,63.5
N$372  (via drill 1.02)
  other vias: 209.42,63.5
N$373  (via drill 1.02)
  other vias: 206.88,63.5
N$374  (via drill 1.02)
  other vias: 180.21,30.48
N$375  (via drill 1.02)
  other vias: 177.67,30.48
N$376  (via drill 1.02)
  other vias: 262.76,66.04
N$377  (via drill 1.02)
  other vias: 260.22,66.04
N$378  (via drill 1.02)
  other vias: 257.68,66.04
N$379  (via drill 1.02)
  other vias: 255.14,66.04
N$380  (via drill 1.02)
  other vias: 252.6,66.04
N$381  (via drill 1.02)
  other vias: 250.06,66.04
N$382  (via drill 1.02)
  other vias: 247.52,66.04
N$383  (via drill 1.02)
  other vias: 244.98,66.04
N$384  (via drill 1.02)
  other vias: 242.44,66.04
N$385  (via drill 1.02)
  other vias: 239.9,66.04
N$386  (via drill 1.02)
  other vias: 237.36,66.04
N$387  (via drill 1.02)
  other vias: 234.82,66.04
N$388  (via drill 1.02)
  other vias: 232.28,66.04
N$389  (via drill 1.02)
  other vias: 229.74,66.04
N$390  (via drill 1.02)
  other vias: 227.2,66.04
N$391  (via drill 1.02)
  other vias: 224.66,66.04
N$392  (via drill 1.02)
  other vias: 222.12,66.04
N$393  (via drill 1.02)
  other vias: 219.58,66.04
N$394  (via drill 1.02)
  other vias: 217.04,66.04
N$395  (via drill 1.02)
  other vias: 214.5,66.04
N$396  (via drill 1.02)
  other vias: 211.96,66.04
N$397  (via drill 1.02)
  other vias: 209.42,66.04
N$398  (via drill 1.02)
  other vias: 206.88,66.04
N$399  (via drill 1.02)
  other vias: 175.13,30.48
N$400  (via drill 1.02)
  other vias: 172.59,30.48
N$401  (via drill 1.02)
  other vias: 262.76,68.58
N$402  (via drill 1.02)
  other vias: 260.22,68.58
N$403  (via drill 1.02)
  other vias: 257.68,68.58
N$404  (via drill 1.02)
  other vias: 255.14,68.58
N$405  (via drill 1.02)
  other vias: 252.6,68.58
N$406  (via drill 1.02)
  other vias: 250.06,68.58
N$407  (via drill 1.02)
  other vias: 247.52,68.58
N$408  (via drill 1.02)
  other vias: 244.98,68.58
N$409  (via drill 1.02)
  other vias: 242.44,68.58
N$410  (via drill 1.02)
  other vias: 239.9,68.58
N$411  (via drill 1.02)
  other vias: 237.36,68.58
N$412  (via drill 1.02)
  other vias: 234.82,68.58
N$413  (via drill 1.02)
  other vias: 232.28,68.58
N$414  (via drill 1.02)
  other vias: 229.74,68.58
N$415  (via drill 1.02)
  other vias: 227.2,68.58
N$416  (via drill 1.02)
  other vias: 224.66,68.58
N$417  (via drill 1.02)
  other vias: 222.12,68.58
N$418  (via drill 1.02)
  other vias: 219.58,68.58
N$419  (via drill 1.02)
  other vias: 217.04,68.58
N$420  (via drill 1.02)
  other vias: 214.5,68.58
N$421  (via drill 1.02)
  other vias: 211.96,68.58
N$422  (via drill 1.02)
  other vias: 209.42,68.58
N$423  (via drill 1.02)
  other vias: 206.88,68.58
N$424  (via drill 1.02)
  other vias: 170.05,30.48
N$425  (via drill 1.02)
  other vias: 167.51,30.48
N$426  (via drill 1.02)
  other vias: 262.76,71.12
N$427  (via drill 1.02)
  other vias: 260.22,71.12
N$428  (via drill 1.02)
  other vias: 257.68,71.12
N$429  (via drill 1.02)
  other vias: 255.14,71.12
N$430  (via drill 1.02)
  other vias: 252.6,71.12
N$431  (via drill 1.02)
  other vias: 250.06,71.12
N$432  (via drill 1.02)
  other vias: 247.52,71.12
N$433  (via drill 1.02)
  other vias: 244.98,71.12
N$434  (via drill 1.02)
  other vias: 242.44,71.12
N$435  (via drill 1.02)
  other vias: 239.9,71.12
N$436  (via drill 1.02)
  other vias: 237.36,71.12
N$437  (via drill 1.02)
  other vias: 234.82,71.12
N$438  (via drill 1.02)
  other vias: 232.28,71.12
N$439  (via drill 1.02)
  other vias: 229.74,71.12
N$440  (via drill 1.02)
  other vias: 227.2,71.12
N$441  (via drill 1.02)
  other vias: 224.66,71.12
N$442  (via drill 1.02)
  other vias: 222.12,71.12
N$443  (via drill 1.02)
  other vias: 219.58,71.12
N$444  (via drill 1.02)
  other vias: 217.04,71.12
N$445  (via drill 1.02)
  other vias: 214.5,71.12
N$446  (via drill 1.02)
  other vias: 211.96,71.12
N$447  (via drill 1.02)
  other vias: 209.42,71.12
N$448  (via drill 1.02)
  other vias: 206.88,71.12
N$449  (via drill 1.02)
  other vias: 164.97,30.48
N$450  (via drill 1.02)
  other vias: 162.43,30.48
N$451  (via drill 1.02)
  other vias: 262.76,73.66
N$452  (via drill 1.02)
  other vias: 260.22,73.66
N$453  (via drill 1.02)
  other vias: 257.68,73.66
N$454  (via drill 1.02)
  other vias: 255.14,73.66
N$455  (via drill 1.02)
  other vias: 252.6,73.66
N$456  (via drill 1.02)
  other vias: 250.06,73.66
N$457  (via drill 1.02)
  other vias: 247.52,73.66
N$458  (via drill 1.02)
  other vias: 244.98,73.66
N$459  (via drill 1.02)
  other vias: 242.44,73.66
N$460  (via drill 1.02)
  other vias: 239.9,73.66
N$461  (via drill 1.02)
  other vias: 237.36,73.66
N$462  (via drill 1.02)
  other vias: 234.82,73.66
N$463  (via drill 1.02)
  other vias: 232.28,73.66
N$464  (via drill 1.02)
  other vias: 229.74,73.66
N$465  (via drill 1.02)
  other vias: 227.2,73.66
N$466  (via drill 1.02)
  other vias: 224.66,73.66
N$467  (via drill 1.02)
  other vias: 222.12,73.66
N$468  (via drill 1.02)
  other vias: 219.58,73.66
N$469  (via drill 1.02)
  other vias: 217.04,73.66
N$470  (via drill 1.02)
  other vias: 214.5,73.66
N$471  (via drill 1.02)
  other vias: 211.96,73.66
N$472  (via drill 1.02)
  other vias: 209.42,73.66
N$473  (via drill 1.02)
  other vias: 206.88,73.66
N$474  (via drill 1.02)
  other vias: 159.89,30.48
N$475  (via drill 1.02)
  other vias: 157.35,30.48
N$476  (via drill 1.02)
  other vias: 262.76,76.2
N$477  (via drill 1.02)
  other vias: 260.22,76.2
N$478  (via drill 1.02)
  other vias: 257.68,76.2
N$479  (via drill 1.02)
  other vias: 255.14,76.2
N$480  (via drill 1.02)
  other vias: 252.6,76.2
N$481  (via drill 1.02)
  other vias: 250.06,76.2
N$482  (via drill 1.02)
  other vias: 247.52,76.2
N$483  (via drill 1.02)
  other vias: 244.98,76.2
N$484  (via drill 1.02)
  other vias: 242.44,76.2
N$485  (via drill 1.02)
  other vias: 239.9,76.2
N$486  (via drill 1.02)
  other vias: 237.36,76.2
N$487  (via drill 1.02)
  other vias: 234.82,76.2
N$488  (via drill 1.02)
  other vias: 232.28,76.2
N$489  (via drill 1.02)
  other vias: 229.74,76.2
N$490  (via drill 1.02)
  other vias: 227.2,76.2
N$491  (via drill 1.02)
  other vias: 224.66,76.2
N$492  (via drill 1.02)
  other vias: 222.12,76.2
N$493  (via drill 1.02)
  other vias: 219.58,76.2
N$494  (via drill 1.02)
  other vias: 217.04,76.2
N$495  (via drill 1.02)
  other vias: 214.5,76.2
N$496  (via drill 1.02)
  other vias: 211.96,76.2
N$497  (via drill 1.02)
  other vias: 209.42,76.2
N$498  (via drill 1.02)
  other vias: 206.88,76.2
N$499  (via drill 1.02)
  other vias: 154.81,30.48
N$500  (via drill 1.02)
  other vias: 152.27,30.48
N$501  (via drill 1.02)
  other vias: 262.76,78.74
N$502  (via drill 1.02)
  other vias: 260.22,78.74
N$503  (via drill 1.02)
  other vias: 257.68,78.74
N$504  (via drill 1.02)
  other vias: 255.14,78.74
N$505  (via drill 1.02)
  other vias: 252.6,78.74
N$506  (via drill 1.02)
  other vias: 250.06,78.74
N$507  (via drill 1.02)
  other vias: 247.52,78.74
N$508  (via drill 1.02)
  other vias: 244.98,78.74
N$509  (via drill 1.02)
  other vias: 242.44,78.74
N$510  (via drill 1.02)
  other vias: 239.9,78.74
N$511  (via drill 1.02)
  other vias: 237.36,78.74
N$512  (via drill 1.02)
  other vias: 234.82,78.74
N$513  (via drill 1.02)
  other vias: 232.28,78.74
N$514  (via drill 1.02)
  other vias: 229.74,78.74
N$515  (via drill 1.02)
  other vias: 227.2,78.74
N$516  (via drill 1.02)
  other vias: 224.66,78.74
N$517  (via drill 1.02)
  other vias: 222.12,78.74
N$518  (via drill 1.02)
  other vias: 219.58,78.74
N$519  (via drill 1.02)
  other vias: 217.04,78.74
N$520  (via drill 1.02)
  other vias: 214.5,78.74
N$521  (via drill 1.02)
  other vias: 211.96,78.74
N$522  (via drill 1.02)
  other vias: 209.42,78.74
N$523  (via drill 1.02)
  other vias: 206.88,78.74
N$524  (via drill 1.02)
  other vias: 149.73,30.48
N$525  (via drill 1.02)
  other vias: 147.19,30.48
N$526  (via drill 1.02)
  other vias: 262.76,81.28
N$527  (via drill 1.02)
  other vias: 260.22,81.28
N$528  (via drill 1.02)
  other vias: 257.68,81.28
N$529  (via drill 1.02)
  other vias: 255.14,81.28
N$530  (via drill 1.02)
  other vias: 252.6,81.28
N$531  (via drill 1.02)
  other vias: 250.06,81.28
N$532  (via drill 1.02)
  other vias: 247.52,81.28
N$533  (via drill 1.02)
  other vias: 244.98,81.28
N$534  (via drill 1.02)
  other vias: 242.44,81.28
N$535  (via drill 1.02)
  other vias: 239.9,81.28
N$536  (via drill 1.02)
  other vias: 237.36,81.28
N$537  (via drill 1.02)
  other vias: 234.82,81.28
N$538  (via drill 1.02)
  other vias: 232.28,81.28
N$539  (via drill 1.02)
  other vias: 229.74,81.28
N$540  (via drill 1.02)
  other vias: 227.2,81.28
N$541  (via drill 1.02)
  other vias: 224.66,81.28
N$542  (via drill 1.02)
  other vias: 222.12,81.28
N$543  (via drill 1.02)
  other vias: 219.58,81.28
N$544  (via drill 1.02)
  other vias: 217.04,81.28
N$545  (via drill 1.02)
  other vias: 214.5,81.28
N$546  (via drill 1.02)
  other vias: 211.96,81.28
N$547  (via drill 1.02)
  other vias: 209.42,81.28
N$548  (via drill 1.02)
  other vias: 206.88,81.28
N$549  (via drill 1.02)
  other vias: 144.65,30.48
N$550  (via drill 1.02)
  other vias: 142.11,30.48
N$551  (via drill 1.02)
  other vias: 262.76,83.82
N$552  (via drill 1.02)
  other vias: 260.22,83.82
N$553  (via drill 1.02)
  other vias: 257.68,83.82
N$554  (via drill 1.02)
  other vias: 255.14,83.82
N$555  (via drill 1.02)
  other vias: 252.6,83.82
N$556  (via drill 1.02)
  other vias: 250.06,83.82
N$557  (via drill 1.02)
  other vias: 247.52,83.82
N$558  (via drill 1.02)
  other vias: 244.98,83.82
N$559  (via drill 1.02)
  other vias: 242.44,83.82
N$560  (via drill 1.02)
  other vias: 239.9,83.82
N$561  (via drill 1.02)
  other vias: 237.36,83.82
N$562  (via drill 1.02)
  other vias: 234.82,83.82
N$563  (via drill 1.02)
  other vias: 232.28,83.82
N$564  (via drill 1.02)
  other vias: 229.74,83.82
N$565  (via drill 1.02)
  other vias: 227.2,83.82
N$566  (via drill 1.02)
  other vias: 224.66,83.82
N$567  (via drill 1.02)
  other vias: 222.12,83.82
N$568  (via drill 1.02)
  other vias: 219.58,83.82
N$569  (via drill 1.02)
  other vias: 217.04,83.82
N$570  (via drill 1.02)
  other vias: 214.5,83.82
N$571  (via drill 1.02)
  other vias: 211.96,83.82
N$572  (via drill 1.02)
  other vias: 209.42,83.82
N$573  (via drill 1.02)
  other vias: 206.88,83.82
N$574  (via drill 1.02)
  other vias: 139.57,30.48
N$575  (via drill 1.02)
  other vias: 137.03,30.48
N$576  (via drill 1.02)
  other vias: 262.76,86.36
N$577  (via drill 1.02)
  other vias: 260.22,86.36
N$578  (via drill 1.02)
  other vias: 257.68,86.36
N$579  (via drill 1.02)
  other vias: 255.14,86.36
N$580  (via drill 1.02)
  other vias: 252.6,86.36
N$581  (via drill 1.02)
  other vias: 250.06,86.36
N$582  (via drill 1.02)
  other vias: 247.52,86.36
N$583  (via drill 1.02)
  other vias: 244.98,86.36
N$584  (via drill 1.02)
  other vias: 242.44,86.36
N$585  (via drill 1.02)
  other vias: 239.9,86.36
N$586  (via drill 1.02)
  other vias: 237.36,86.36
N$587  (via drill 1.02)
  other vias: 234.82,86.36
N$588  (via drill 1.02)
  other vias: 232.28,86.36
N$589  (via drill 1.02)
  other vias: 229.74,86.36
N$590  (via drill 1.02)
  other vias: 227.2,86.36
N$591  (via drill 1.02)
  other vias: 224.66,86.36
N$592  (via drill 1.02)
  other vias: 222.12,86.36
N$593  (via drill 1.02)
  other vias: 219.58,86.36
N$594  (via drill 1.02)
  other vias: 217.04,86.36
N$595  (via drill 1.02)
  other vias: 214.5,86.36
N$596  (via drill 1.02)
  other vias: 211.96,86.36
N$597  (via drill 1.02)
  other vias: 209.42,86.36
N$598  (via drill 1.02)
  other vias: 206.88,86.36
N$599  (via drill 1.02)
  other vias: 192.91,33.02
N$600  (via drill 1.02)
  other vias: 190.37,33.02
N$601  (via drill 1.02)
  other vias: 262.76,88.9
N$602  (via drill 1.02)
  other vias: 260.22,88.9
N$603  (via drill 1.02)
  other vias: 257.68,88.9
N$604  (via drill 1.02)
  other vias: 255.14,88.9
N$605  (via drill 1.02)
  other vias: 252.6,88.9
N$606  (via drill 1.02)
  other vias: 250.06,88.9
N$607  (via drill 1.02)
  other vias: 247.52,88.9
N$608  (via drill 1.02)
  other vias: 244.98,88.9
N$609  (via drill 1.02)
  other vias: 242.44,88.9
N$610  (via drill 1.02)
  other vias: 239.9,88.9
N$611  (via drill 1.02)
  other vias: 237.36,88.9
N$612  (via drill 1.02)
  other vias: 234.82,88.9
N$613  (via drill 1.02)
  other vias: 232.28,88.9
N$614  (via drill 1.02)
  other vias: 229.74,88.9
N$615  (via drill 1.02)
  other vias: 227.2,88.9
N$616  (via drill 1.02)
  other vias: 224.66,88.9
N$617  (via drill 1.02)
  other vias: 222.12,88.9
N$618  (via drill 1.02)
  other vias: 219.58,88.9
N$619  (via drill 1.02)
  other vias: 217.04,88.9
N$620  (via drill 1.02)
  other vias: 214.5,88.9
N$621  (via drill 1.02)
  other vias: 211.96,88.9
N$622  (via drill 1.02)
  other vias: 209.42,88.9
N$623  (via drill 1.02)
  other vias: 206.88,88.9
N$624  (via drill 1.02)
  other vias: 187.83,33.02
N$625  (via drill 1.02)
  other vias: 185.29,33.02
N$626  (via drill 1.02)
  other vias: 262.76,91.44
N$627  (via drill 1.02)
  other vias: 260.22,91.44
N$628  (via drill 1.02)
  other vias: 257.68,91.44
N$629  (via drill 1.02)
  other vias: 255.14,91.44
N$630  (via drill 1.02)
  other vias: 252.6,91.44
N$631  (via drill 1.02)
  other vias: 250.06,91.44
N$632  (via drill 1.02)
  other vias: 247.52,91.44
N$633  (via drill 1.02)
  other vias: 244.98,91.44
N$634  (via drill 1.02)
  other vias: 242.44,91.44
N$635  (via drill 1.02)
  other vias: 239.9,91.44
N$636  (via drill 1.02)
  other vias: 237.36,91.44
N$637  (via drill 1.02)
  other vias: 234.82,91.44
N$638  (via drill 1.02)
  other vias: 232.28,91.44
N$639  (via drill 1.02)
  other vias: 229.74,91.44
N$640  (via drill 1.02)
  other vias: 227.2,91.44
N$641  (via drill 1.02)
  other vias: 224.66,91.44
N$642  (via drill 1.02)
  other vias: 222.12,91.44
N$643  (via drill 1.02)
  other vias: 219.58,91.44
N$644  (via drill 1.02)
  other vias: 217.04,91.44
N$645  (via drill 1.02)
  other vias: 214.5,91.44
N$646  (via drill 1.02)
  other vias: 211.96,91.44
N$647  (via drill 1.02)
  other vias: 209.42,91.44
N$648  (via drill 1.02)
  other vias: 206.88,91.44
N$649  (via drill 1.02)
  other vias: 182.75,33.02
N$650  (via drill 1.02)
  other vias: 180.21,33.02
N$651  (via drill 1.02)
  other vias: 262.76,93.98
N$652  (via drill 1.02)
  other vias: 260.22,93.98
N$653  (via drill 1.02)
  other vias: 257.68,93.98
N$654  (via drill 1.02)
  other vias: 255.14,93.98
N$655  (via drill 1.02)
  other vias: 252.6,93.98
N$656  (via drill 1.02)
  other vias: 250.06,93.98
N$657  (via drill 1.02)
  other vias: 247.52,93.98
N$658  (via drill 1.02)
  other vias: 244.98,93.98
N$659  (via drill 1.02)
  other vias: 242.44,93.98
N$660  (via drill 1.02)
  other vias: 239.9,93.98
N$661  (via drill 1.02)
  other vias: 237.36,93.98
N$662  (via drill 1.02)
  other vias: 234.82,93.98
N$663  (via drill 1.02)
  other vias: 232.28,93.98
N$664  (via drill 1.02)
  other vias: 229.74,93.98
N$665  (via drill 1.02)
  other vias: 227.2,93.98
N$666  (via drill 1.02)
  other vias: 224.66,93.98
N$667  (via drill 1.02)
  other vias: 222.12,93.98
N$668  (via drill 1.02)
  other vias: 219.58,93.98
N$669  (via drill 1.02)
  other vias: 217.04,93.98
N$670  (via drill 1.02)
  other vias: 214.5,93.98
N$671  (via drill 1.02)
  other vias: 211.96,93.98
N$672  (via drill 1.02)
  other vias: 209.42,93.98
N$673  (via drill 1.02)
  other vias: 206.88,93.98
N$674  (via drill 1.02)
  other vias: 177.67,33.02
N$675  (via drill 1.02)
  other vias: 175.13,33.02
N$676  (via drill 1.02)
  other vias: 262.76,96.52
N$677  (via drill 1.02)
  other vias: 260.22,96.52
N$678  (via drill 1.02)
  other vias: 257.68,96.52
N$679  (via drill 1.02)
  other vias: 255.14,96.52
N$680  (via drill 1.02)
  other vias: 252.6,96.52
N$681  (via drill 1.02)
  other vias: 250.06,96.52
N$682  (via drill 1.02)
  other vias: 247.52,96.52
N$683  (via drill 1.02)
  other vias: 244.98,96.52
N$684  (via drill 1.02)
  other vias: 242.44,96.52
N$685  (via drill 1.02)
  other vias: 239.9,96.52
N$686  (via drill 1.02)
  other vias: 237.36,96.52
N$687  (via drill 1.02)
  other vias: 234.82,96.52
N$688  (via drill 1.02)
  other vias: 232.28,96.52
N$689  (via drill 1.02)
  other vias: 229.74,96.52
N$690  (via drill 1.02)
  other vias: 227.2,96.52
N$691  (via drill 1.02)
  other vias: 224.66,96.52
N$692  (via drill 1.02)
  other vias: 222.12,96.52
N$693  (via drill 1.02)
  other vias: 219.58,96.52
N$694  (via drill 1.02)
  other vias: 217.04,96.52
N$695  (via drill 1.02)
  other vias: 214.5,96.52
N$696  (via drill 1.02)
  other vias: 211.96,96.52
N$697  (via drill 1.02)
  other vias: 209.42,96.52
N$698  (via drill 1.02)
  other vias: 206.88,96.52
N$699  (via drill 1.02)
  other vias: 172.59,33.02
N$700  (via drill 1.02)
  other vias: 170.05,33.02
N$701  (via drill 1.02)
  other vias: 262.76,99.06
N$702  (via drill 1.02)
  other vias: 260.22,99.06
N$703  (via drill 1.02)
  other vias: 257.68,99.06
N$704  (via drill 1.02)
  other vias: 255.14,99.06
N$705  (via drill 1.02)
  other vias: 252.6,99.06
N$706  (via drill 1.02)
  other vias: 250.06,99.06
N$707  (via drill 1.02)
  other vias: 247.52,99.06
N$708  (via drill 1.02)
  other vias: 244.98,99.06
N$709  (via drill 1.02)
  other vias: 242.44,99.06
N$710  (via drill 1.02)
  other vias: 239.9,99.06
N$711  (via drill 1.02)
  other vias: 237.36,99.06
N$712  (via drill 1.02)
  other vias: 234.82,99.06
N$713  (via drill 1.02)
  other vias: 232.28,99.06
N$714  (via drill 1.02)
  other vias: 229.74,99.06
N$715  (via drill 1.02)
  other vias: 227.2,99.06
N$716  (via drill 1.02)
  other vias: 224.66,99.06
N$717  (via drill 1.02)
  other vias: 222.12,99.06
N$718  (via drill 1.02)
  other vias: 219.58,99.06
N$719  (via drill 1.02)
  other vias: 217.04,99.06
N$720  (via drill 1.02)
  other vias: 214.5,99.06
N$721  (via drill 1.02)
  other vias: 211.96,99.06
N$722  (via drill 1.02)
  other vias: 209.42,99.06
N$723  (via drill 1.02)
  other vias: 206.88,99.06
N$724  (via drill 1.02)
  other vias: 167.51,33.02
N$725  (via drill 1.02)
  other vias: 164.97,33.02
N$726  (via drill 1.02)
  other vias: 262.76,101.6
N$727  (via drill 1.02)
  other vias: 260.22,101.6
N$728  (via drill 1.02)
  other vias: 257.68,101.6
N$729  (via drill 1.02)
  other vias: 255.14,101.6
N$730  (via drill 1.02)
  other vias: 252.6,101.6
N$731  (via drill 1.02)
  other vias: 250.06,101.6
N$732  (via drill 1.02)
  other vias: 247.52,101.6
N$733  (via drill 1.02)
  other vias: 244.98,101.6
N$734  (via drill 1.02)
  other vias: 242.44,101.6
N$735  (via drill 1.02)
  other vias: 239.9,101.6
N$736  (via drill 1.02)
  other vias: 237.36,101.6
N$737  (via drill 1.02)
  other vias: 234.82,101.6
N$738  (via drill 1.02)
  other vias: 232.28,101.6
N$739  (via drill 1.02)
  other vias: 229.74,101.6
N$740  (via drill 1.02)
  other vias: 227.2,101.6
N$741  (via drill 1.02)
  other vias: 224.66,101.6
N$742  (via drill 1.02)
  other vias: 222.12,101.6
N$743  (via drill 1.02)
  other vias: 219.58,101.6
N$744  (via drill 1.02)
  other vias: 217.04,101.6
N$745  (via drill 1.02)
  other vias: 214.5,101.6
N$746  (via drill 1.02)
  other vias: 211.96,101.6
N$747  (via drill 1.02)
  other vias: 209.42,101.6
N$748  (via drill 1.02)
  other vias: 206.88,101.6
N$749  (via drill 1.02)
  other vias: 162.43,33.02
N$750  (via drill 1.02)
  other vias: 159.89,33.02
N$751  (via drill 1.02)
  other vias: 262.76,104.14
N$752  (via drill 1.02)
  other vias: 260.22,104.14
N$753  (via drill 1.02)
  other vias: 257.68,104.14
N$754  (via drill 1.02)
  other vias: 255.14,104.14
N$755  (via drill 1.02)
  other vias: 252.6,104.14
N$756  (via drill 1.02)
  other vias: 250.06,104.14
N$757  (via drill 1.02)
  other vias: 247.52,104.14
N$758  (via drill 1.02)
  other vias: 244.98,104.14
N$759  (via drill 1.02)
  other vias: 242.44,104.14
N$760  (via drill 1.02)
  other vias: 239.9,104.14
N$761  (via drill 1.02)
  other vias: 237.36,104.14
N$762  (via drill 1.02)
  other vias: 234.82,104.14
N$763  (via drill 1.02)
  other vias: 232.28,104.14
N$764  (via drill 1.02)
  other vias: 229.74,104.14
N$765  (via drill 1.02)
  other vias: 227.2,104.14
N$766  (via drill 1.02)
  other vias: 224.66,104.14
N$767  (via drill 1.02)
  other vias: 222.12,104.14
N$768  (via drill 1.02)
  other vias: 219.58,104.14
N$769  (via drill 1.02)
  other vias: 217.04,104.14
N$770  (via drill 1.02)
  other vias: 214.5,104.14
N$771  (via drill 1.02)
  other vias: 211.96,104.14
N$772  (via drill 1.02)
  other vias: 209.42,104.14
N$773  (via drill 1.02)
  other vias: 206.88,104.14
N$774  (via drill 1.02)
  other vias: 157.35,33.02
N$775  (via drill 1.02)
  other vias: 154.81,33.02
N$776  (via drill 1.02)
  other vias: 262.76,106.68
N$777  (via drill 1.02)
  other vias: 260.22,106.68
N$778  (via drill 1.02)
  other vias: 257.68,106.68
N$779  (via drill 1.02)
  other vias: 255.14,106.68
N$780  (via drill 1.02)
  other vias: 252.6,106.68
N$781  (via drill 1.02)
  other vias: 250.06,106.68
N$782  (via drill 1.02)
  other vias: 247.52,106.68
N$783  (via drill 1.02)
  other vias: 244.98,106.68
N$784  (via drill 1.02)
  other vias: 242.44,106.68
N$785  (via drill 1.02)
  other vias: 239.9,106.68
N$786  (via drill 1.02)
  other vias: 237.36,106.68
N$787  (via drill 1.02)
  other vias: 234.82,106.68
N$788  (via drill 1.02)
  other vias: 232.28,106.68
N$789  (via drill 1.02)
  other vias: 229.74,106.68
N$790  (via drill 1.02)
  other vias: 227.2,106.68
N$791  (via drill 1.02)
  other vias: 224.66,106.68
N$792  (via drill 1.02)
  other vias: 222.12,106.68
N$793  (via drill 1.02)
  other vias: 219.58,106.68
N$794  (via drill 1.02)
  other vias: 217.04,106.68
N$795  (via drill 1.02)
  other vias: 214.5,106.68
N$796  (via drill 1.02)
  other vias: 211.96,106.68
N$797  (via drill 1.02)
  other vias: 209.42,106.68
N$798  (via drill 1.02)
  other vias: 206.88,106.68
N$799  (via drill 1.02)
  other vias: 152.27,33.02
N$800  (via drill 1.02)
  other vias: 149.73,33.02
N$801  (via drill 1.02)
  other vias: 262.76,109.22
N$802  (via drill 1.02)
  other vias: 260.22,109.22
N$803  (via drill 1.02)
  other vias: 257.68,109.22
N$804  (via drill 1.02)
  other vias: 255.14,109.22
N$805  (via drill 1.02)
  other vias: 252.6,109.22
N$806  (via drill 1.02)
  other vias: 250.06,109.22
N$807  (via drill 1.02)
  other vias: 247.52,109.22
N$808  (via drill 1.02)
  other vias: 244.98,109.22
N$809  (via drill 1.02)
  other vias: 242.44,109.22
N$810  (via drill 1.02)
  other vias: 239.9,109.22
N$811  (via drill 1.02)
  other vias: 237.36,109.22
N$812  (via drill 1.02)
  other vias: 234.82,109.22
N$813  (via drill 1.02)
  other vias: 232.28,109.22
N$814  (via drill 1.02)
  other vias: 229.74,109.22
N$815  (via drill 1.02)
  other vias: 227.2,109.22
N$816  (via drill 1.02)
  other vias: 224.66,109.22
N$817  (via drill 1.02)
  other vias: 222.12,109.22
N$818  (via drill 1.02)
  other vias: 219.58,109.22
N$819  (via drill 1.02)
  other vias: 217.04,109.22
N$820  (via drill 1.02)
  other vias: 214.5,109.22
N$821  (via drill 1.02)
  other vias: 211.96,109.22
N$822  (via drill 1.02)
  other vias: 209.42,109.22
N$823  (via drill 1.02)
  other vias: 206.88,109.22
N$824  (via drill 1.02)
  other vias: 147.19,33.02
N$825  (via drill 1.02)
  other vias: 144.65,33.02
N$826  (via drill 1.02)
  other vias: 262.76,111.76
N$827  (via drill 1.02)
  other vias: 260.22,111.76
N$828  (via drill 1.02)
  other vias: 257.68,111.76
N$829  (via drill 1.02)
  other vias: 255.14,111.76
N$830  (via drill 1.02)
  other vias: 252.6,111.76
N$831  (via drill 1.02)
  other vias: 250.06,111.76
N$832  (via drill 1.02)
  other vias: 247.52,111.76
N$833  (via drill 1.02)
  other vias: 244.98,111.76
N$834  (via drill 1.02)
  other vias: 242.44,111.76
N$835  (via drill 1.02)
  other vias: 239.9,111.76
N$836  (via drill 1.02)
  other vias: 237.36,111.76
N$837  (via drill 1.02)
  other vias: 234.82,111.76
N$838  (via drill 1.02)
  other vias: 232.28,111.76
N$839  (via drill 1.02)
  other vias: 229.74,111.76
N$840  (via drill 1.02)
  other vias: 227.2,111.76
N$841  (via drill 1.02)
  other vias: 224.66,111.76
N$842  (via drill 1.02)
  other vias: 222.12,111.76
N$843  (via drill 1.02)
  other vias: 219.58,111.76
N$844  (via drill 1.02)
  other vias: 217.04,111.76
N$845  (via drill 1.02)
  other vias: 214.5,111.76
N$846  (via drill 1.02)
  other vias: 211.96,111.76
N$847  (via drill 1.02)
  other vias: 209.42,111.76
N$848  (via drill 1.02)
  other vias: 206.88,111.76
N$849  (via drill 1.02)
  other vias: 142.11,33.02
N$850  (via drill 1.02)
  other vias: 139.57,33.02
N$851  (via drill 1.02)
  other vias: 262.76,114.3
N$852  (via drill 1.02)
  other vias: 260.22,114.3
N$853  (via drill 1.02)
  other vias: 257.68,114.3
N$854  (via drill 1.02)
  other vias: 255.14,114.3
N$855  (via drill 1.02)
  other vias: 252.6,114.3
N$856  (via drill 1.02)
  other vias: 250.06,114.3
N$857  (via drill 1.02)
  other vias: 247.52,114.3
N$858  (via drill 1.02)
  other vias: 244.98,114.3
N$859  (via drill 1.02)
  other vias: 242.44,114.3
N$860  (via drill 1.02)
  other vias: 239.9,114.3
N$861  (via drill 1.02)
  other vias: 237.36,114.3
N$862  (via drill 1.02)
  other vias: 234.82,114.3
N$863  (via drill 1.02)
  other vias: 232.28,114.3
N$864  (via drill 1.02)
  other vias: 229.74,114.3
N$865  (via drill 1.02)
  other vias: 227.2,114.3
N$866  (via drill 1.02)
  other vias: 224.66,114.3
N$867  (via drill 1.02)
  other vias: 222.12,114.3
N$868  (via drill 1.02)
  other vias: 219.58,114.3
N$869  (via drill 1.02)
  other vias: 217.04,114.3
N$870  (via drill 1.02)
  other vias: 214.5,114.3
N$871  (via drill 1.02)
  other vias: 211.96,114.3
N$872  (via drill 1.02)
  other vias: 209.42,114.3
N$873  (via drill 1.02)
  other vias: 206.88,114.3
N$874  (via drill 1.02)
  other vias: 137.03,33.02
N$875  (via drill 1.02)
  other vias: 192.91,35.56
N$876  (via drill 1.02)